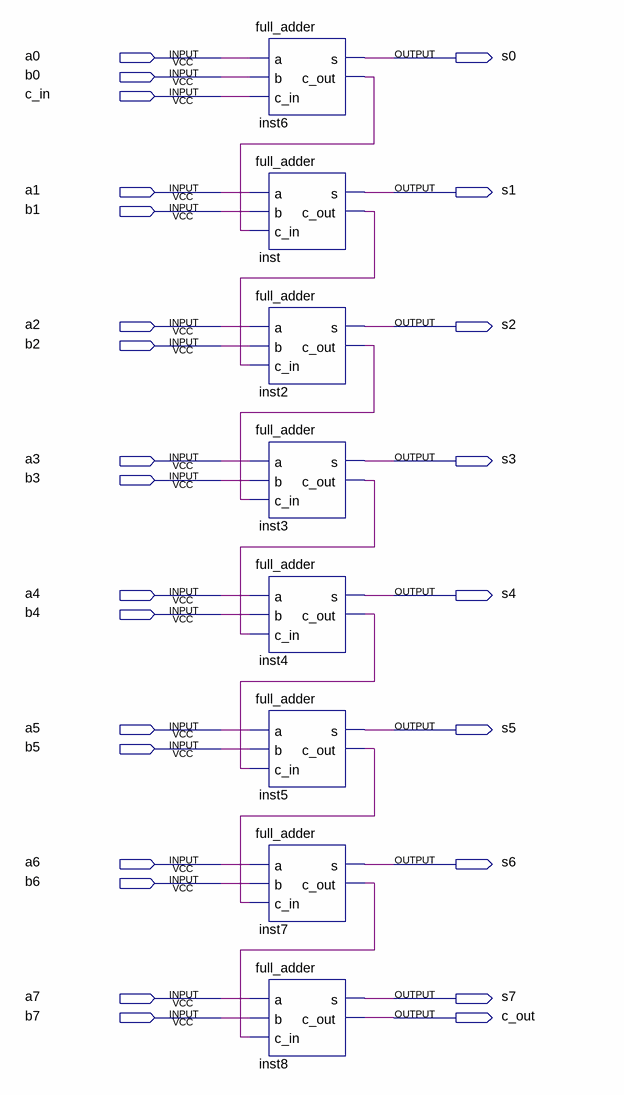
[diagram p0: schematic sheet]
// Quartus schematic adder8.bdf as structural Verilog: 8 symbols, 26 pins
module adder8 (
  input  a0,
  input  b0,
  input  c_in,
  input  a1,
  input  b1,
  input  a2,
  input  b2,
  input  a3,
  input  b3,
  input  a4,
  input  b4,
  input  a5,
  input  b5,
  input  a6,
  input  b6,
  input  a7,
  input  b7,
  output s0,
  output s1,
  output s2,
  output s3,
  output s4,
  output s5,
  output s6,
  output s7,
  output c_out
);

  wire inst2_c_out, inst3_c_out, inst4_c_out, inst5_c_out, inst6_c_out, inst7_c_out, inst_c_out;

  full_adder inst6 (.a(a0), .b(b0), .c_in(c_in), .s(s0), .c_out(inst6_c_out));
  full_adder inst (.a(a1), .b(b1), .c_in(inst6_c_out), .s(s1), .c_out(inst_c_out));
  full_adder inst2 (.a(a2), .b(b2), .c_in(inst_c_out), .s(s2), .c_out(inst2_c_out));
  full_adder inst3 (.a(a3), .b(b3), .c_in(inst2_c_out), .s(s3), .c_out(inst3_c_out));
  full_adder inst4 (.a(a4), .b(b4), .c_in(inst3_c_out), .s(s4), .c_out(inst4_c_out));
  full_adder inst5 (.a(a5), .b(b5), .c_in(inst4_c_out), .s(s5), .c_out(inst5_c_out));
  full_adder inst7 (.a(a6), .b(b6), .c_in(inst5_c_out), .s(s6), .c_out(inst7_c_out));
  full_adder inst8 (.a(a7), .b(b7), .c_in(inst7_c_out), .s(s7), .c_out(c_out));
endmodule
